# Altium schematic sheet fairy_lights_button.SchDoc
size B
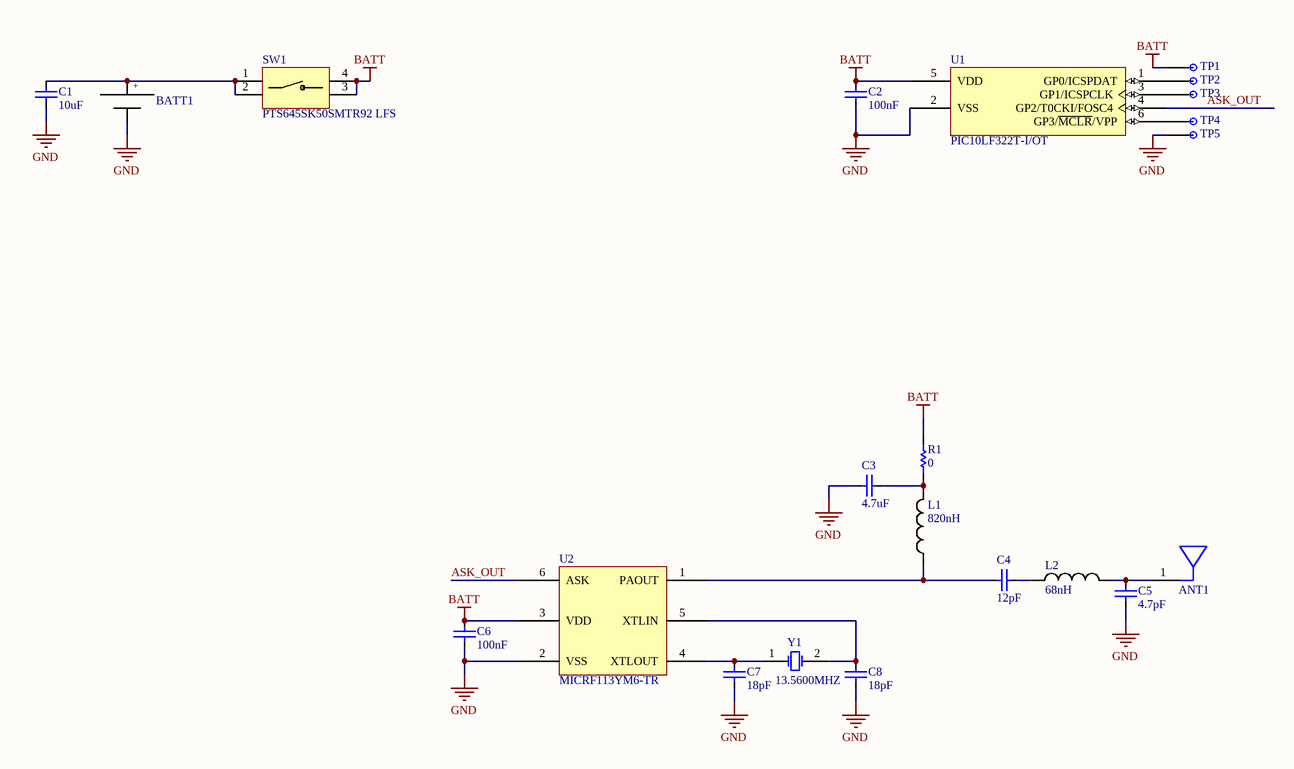
[diagram p0: fairy_lights_button.SchDoc]

## Parts
ANT1  CHIP ANTENNA  [ANT-2.4-CHP]  (value not drawn)
BATT1  BAT-HLD-001  [BAT-HLD-001_BAT-HLD-001(Primary)]  (value not drawn)
C1  10uF  [CAP_0805]
C2  100nF  [CAP_0603]
C3  4.7uF  [CAP_0603]
C4  12pF  [CAP_0603]
C5  4.7pF  [CAP_0603]
C6  100nF  [CAP_0603]
C7  18pF
C8  18pF
L1  Inductance: 820nH  [CAP_0805]  (hidden comment: LQW21HNR82J00L)
L2  Inductance: 68nH  [CAP_0603]  (hidden comment: LQW18AN68NJ00D)
R1  0  [RES_0603]
SW1  PTS645SK50SMTR92 LFS  [SWITCH_TACTILE_6MM]
TP1  TESTPOINT  [PAD_40MIL]  (value not drawn)  (no BOM)
TP2  TESTPOINT  [PAD_40MIL]  (value not drawn)  (no BOM)
TP3  TESTPOINT  [PAD_40MIL]  (value not drawn)  (no BOM)
TP4  TESTPOINT  [PAD_40MIL]  (value not drawn)  (no BOM)
TP5  TESTPOINT  [PAD_40MIL]  (value not drawn)  (no BOM)
U1  PIC10LF322T-I/OT  [SOT-23-OT6_N]
U2  MICRF113YM6-TR  [SOT-23-OT6_N]
Y1  Frequency: 13.5600MHZ  [XTAL_ECS-135.6-20-3X-TR]  (hidden comment: ECS-135.6-20-3X-TR)

## Nets
BATT: C2.1 C6.1 R1.2 SW1.3 SW1.4 TP1.1 U1.5(VDD) U2.3(VDD)
GND: BATT1.NEG C1.2 C2.2 C3.1 C5.2 C6.2 C7.2 C8.2 TP5.1 U1.2(VSS) U2.2(VSS)
ASK_OUT: U1.4(GP2/T0CKI/FOSC4) U2.6(ASK)
NetANT1_1: ANT1.1(FEED) C5.1 L2.2
NetBATT1_POS1: BATT1.POS1 BATT1.POS2 C1.1 SW1.1 SW1.2
NetC3_2: C3.2 L1.2 R1.1
NetC4_1: C4.1 L1.1 U2.1(PAOUT)
NetC4_2: C4.2 L2.1
NetC7_1: C7.1 U2.4(XTLOUT) Y1.1(X1)
NetC8_1: C8.1 U2.5(XTLIN) Y1.2(X2)
NetTP2_1: TP2.1 U1.1(GP0/ICSPDAT)
NetTP3_1: TP3.1 U1.3(GP1/ICSPCLK)
NetTP4_1: TP4.1 U1.6(GP3/~{MCLR}/VPP)

Not connected (* = marked no-connect by the designer): ANT1 2(NC)

## Notes on the sheet
- Title
- Date
- GM Cruise LLC Confidential. Subject to Non-Disclosure Agreement.
- GM Cruise LLC
- Number
- Sheet
- Revision
- of
- (in symbol BAT-HLD-001) +

## Library data of the parts
ANT1 = CHIP ANTENNA: Two terminal chip antenna
BATT1 = BAT-HLD-001: CR2032 Phosphor Bronze / Nickel Plated 20 mm Cell Size Battery Holder
C1-C8 = CAPACITOR
  C1: Capacitance: 10uF
  C2 C6: Capacitance: 100nF
  C3: Capacitance: 4.7uF
  C4: Capacitance: 12pF
  C5: Capacitance: 4.7pF
  C7 C8: Capacitance: 18pF
L1 L2 = INDUCTOR
R1 = RESISTOR: Resistance: 0
SW1 = PUSHBUTTON-SPST-4Term: SPST pushbutton - four terminal
TP1-TP5 = TESTPOINT: Test Point; Part Number: TestPoint SMT 40mil
U1 = PIC10F202T: PIC PIC® 10F Microcontroller IC 8-Bit 16MHz 896B (512 x 14) FLASH SOT-23-6
U2 = MICRF113YM6-TR: RF Transmitter ASK 300MHz ~ 450MHz 10dBm 10 kbps PCB, Surface Mount Antenna SOT-23-6
Y1 = CRYSTAL: ComponentLink1URL: http://www.abracon.com/; ComponentLink2Description: Datasheet; ComponentLink2URL: http://www.abracon.com/Resonators/ABLS2.pdf; ComponentLink1Description: Manufacturer URL